# EAGLE schematic sh j (EAGLE 7.2.0)
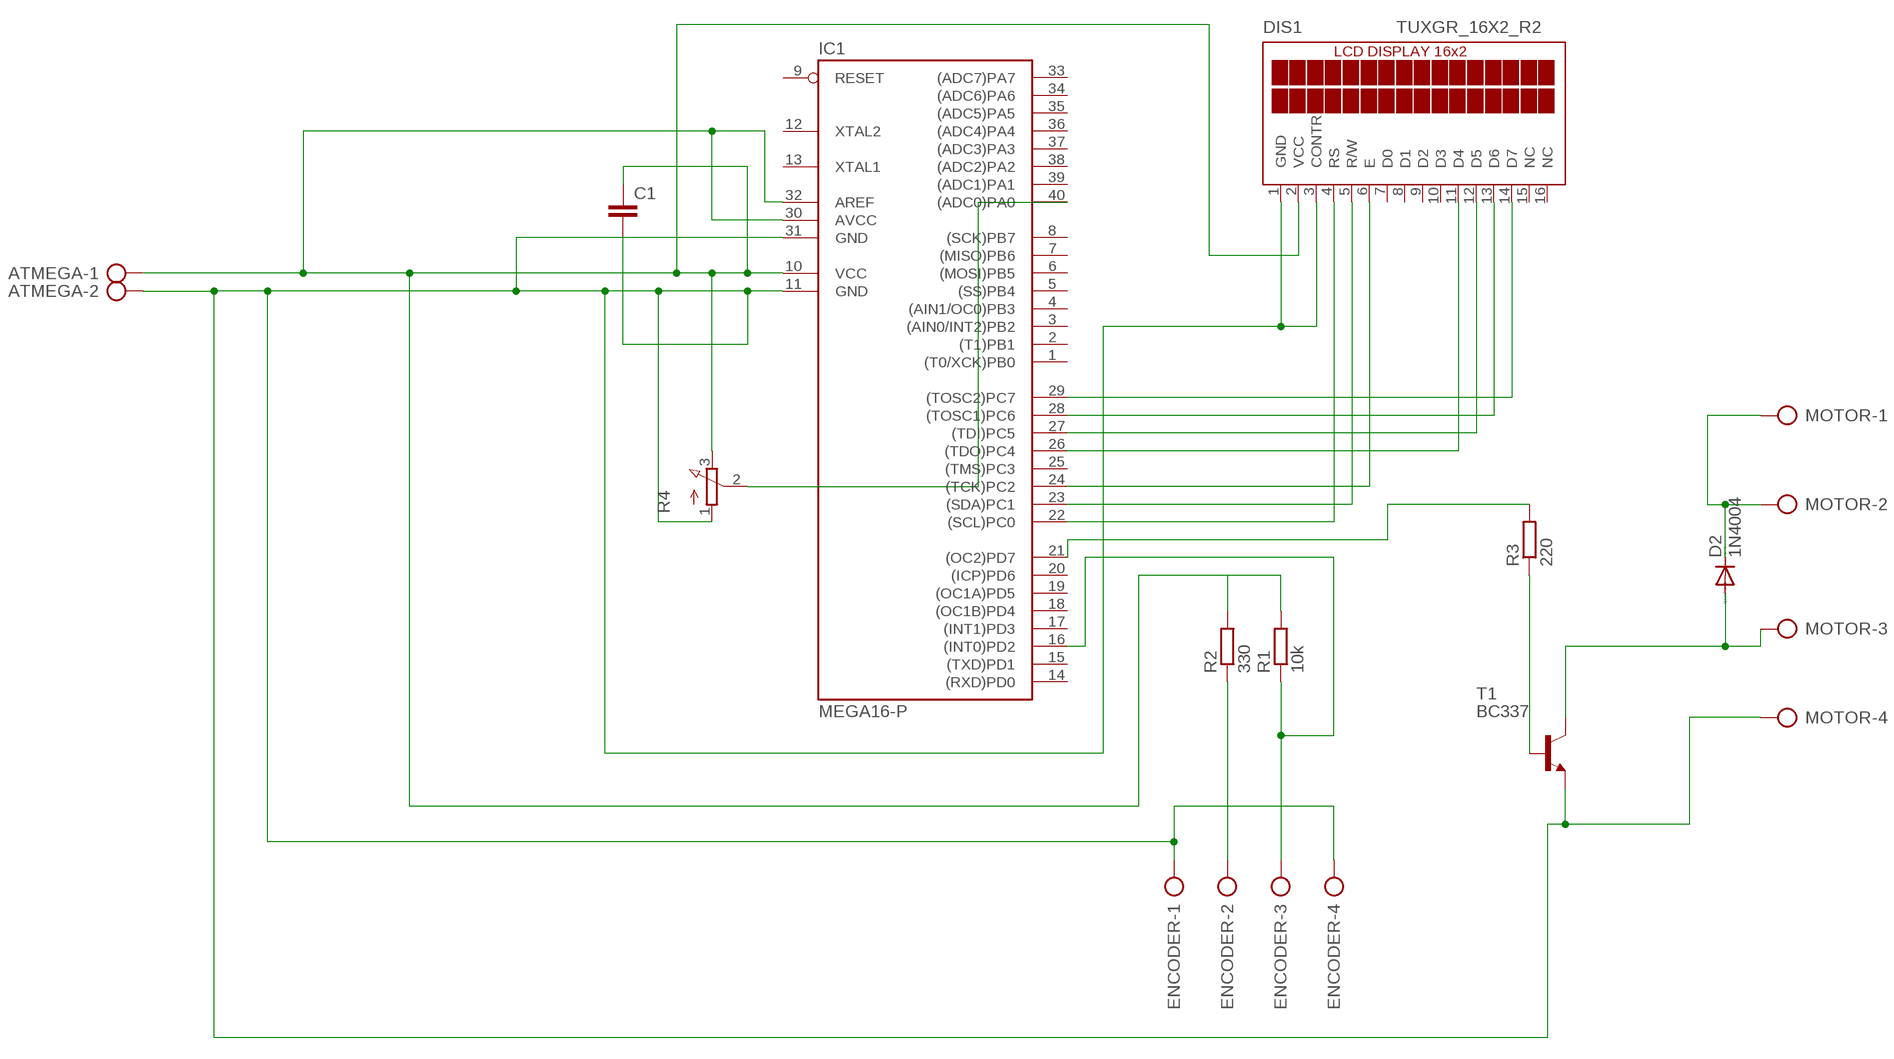
[diagram p0: schematic, sheet 1]

## Parts
ATMEGA  AK500/2-H  [AK500/2-H]
C1  C-EU025-050X050  [C025-050X050]
D2  1N4004  [DO41-10]
DIS1  TUXGR_16X2_R2  [TUXGR_16X2_R2]
ENCODER  AK500/4-H  [AK500/4-H]
IC1  MEGA16-P  [DIL40]
MOTOR  AK500/4-H  [AK500/4-H]
R1  10k  R-EU_0207/10  [0207/10]
R2  330  R-EU_0207/10  [0207/10]
R3  220  R-EU_0207/10  [0207/10]
R4  3RP/1610N  [3RP/1610N]
T1  BC337  [TO92]

## Nets
N$1: DIS1.14(D7) IC1.29((TOSC2)PC7)
N$2: DIS1.13(D6) IC1.28((TOSC1)PC6)
N$3: DIS1.12(D5) IC1.27((TDI)PC5)
N$4: DIS1.11(D4) IC1.26((TDO)PC4)
N$5: DIS1.6(E) IC1.24((TCK)PC2)
N$6: DIS1.5(R/W) IC1.23((SDA)PC1)
N$7: DIS1.4(RS) IC1.22((SCL)PC0)
N$8: ATMEGA.2 C1.2 DIS1.1(GND) DIS1.3(CONTR) ENCODER.1 ENCODER.4 IC1.11(GND) IC1.31(GND) MOTOR.4 R4.1(A) T1.1(E)
N$9: R3.1 T1.2(B)
N$10: IC1.21((OC2)PD7) R3.2
N$11: ENCODER.3 IC1.16((INT0)PD2) R1.1
N$12: D2.C MOTOR.1 MOTOR.2
N$13: D2.A MOTOR.3 T1.3(C)
N$14: IC1.40((ADC0)PA0) R4.2(S)
N$15: ENCODER.2 R2.1
N$18: ATMEGA.1 C1.1 DIS1.2(VCC) IC1.10(VCC) IC1.30(AVCC) IC1.32(AREF) R1.2 R2.2 R4.3(E)
Unconnected: DIS1.7(D0) DIS1.8(D1) DIS1.9(D2) DIS1.10(D3) DIS1.15(NC) DIS1.16(NC) IC1.1((T0/XCK)PB0) IC1.2((T1)PB1) IC1.3((AIN0/INT2)PB2) IC1.4((AIN1/OC0)PB3) IC1.5((SS)PB4) IC1.6((MOSI)PB5) IC1.7((MISO)PB6) IC1.8((SCK)PB7) IC1.9(RESET) IC1.12(XTAL2) IC1.13(XTAL1) IC1.14((RXD)PD0) IC1.15((TXD)PD1) IC1.17((INT1)PD3) IC1.18((OC1B)PD4) IC1.19((OC1A)PD5) IC1.20((ICP)PD6) IC1.25((TMS)PC3) IC1.33((ADC7)PA7) IC1.34((ADC6)PA6) IC1.35((ADC5)PA5) IC1.36((ADC4)PA4) IC1.37((ADC3)PA3) IC1.38((ADC2)PA2) IC1.39((ADC1)PA1)

## Library data of the parts
ATMEGA = con-ptr500:AK500/2-H: CONNECTOR Aug. 2004 / PTR Meßtechnik: Die Bezeichnung der Serie AK505 wurde geändert. Es handelt sich hierbei um AK500 in horizontaler Ausführung.; OC_FARNELL: unknown; OC_NEWARK: unknown
C1 = rcl:C-EU: CAPACITOR, European symbol
D2 = diode:1N4004: DIODE general purpose rectifier, 1 A
DIS1 = display-lcd:TUXGR_16X2_R2: Tuxgraphics LCD display 16x2 characters reflective, without background light Source: tuxgr_12x2_r2.pdf; OC_FARNELL: unknown; OC_NEWARK: unknown
ENCODER MOTOR = con-ptr500:AK500/4-H: CONNECTOR Aug. 2004 / PTR Meßtechnik: Die Bezeichnung der Serie AK505 wurde geändert. Es handelt sich hierbei um AK500 in horizontaler Ausführung.; OC_FARNELL: unknown; OC_NEWARK: unknown
IC1 = atmel:MEGA16-P: MICROCONTROLLER 16 Kbytes FLASH 1 kbytes SRAM 512 bytes EEPROM USART 8-channel 10 bit ADC Source: avr.lbr; MPN: ATMEGA16-16PU; OC_FARNELL: 9171142; OC_NEWARK: 01M6885
R1-R3 = resistor:R-EU_: RESISTOR, European symbol
R4 = pot:3RP/1610N: 16mm Potentiometer one level Source: http://www.alphapotentiometers.net/html/16mm_pot_2.html
T1 = transistor:BC337: NPN TRANSISTOR